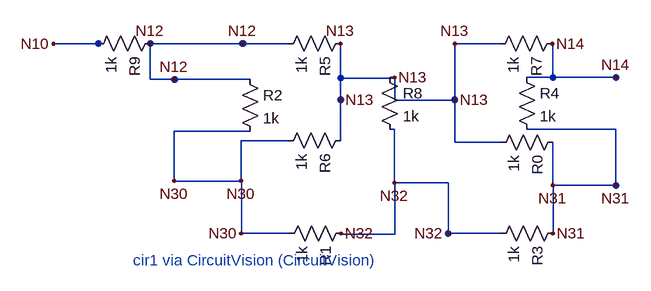
[diagram p0: schematic cir1.asc]
cir1.asc, the LTspice schematic file:
Version 4
SHEET 1 2000 1600
SYMBOL res 702 158 R90
SYMATTR InstName R0
SYMATTR Value 1k
WIRE 686 174 686 240
FLAG 686 240 N31
WIRE 606 174 535 174
WIRE 535 174 535 108
FLAG 535 108 N13
SYMBOL res 376 298 R90
SYMATTR InstName R1
SYMATTR Value 1k
FLAG 360 314 N32
WIRE 280 314 206 314
FLAG 206 314 N30
SYMBOL res 204 61 R0
SYMATTR InstName R2
SYMATTR Value 1k
WIRE 220 77 103 77
FLAG 103 77 N12
WIRE 220 157 103 157
WIRE 103 157 103 233
FLAG 103 233 N30
SYMBOL res 702 298 R90
SYMATTR InstName R3
SYMATTR Value 1k
FLAG 686 314 N31
WIRE 606 314 525 314
FLAG 525 314 N32
SYMBOL res 630 58 R0
SYMATTR InstName R4
SYMATTR Value 1k
WIRE 646 74 783 74
FLAG 783 74 N14
WIRE 646 154 783 154
WIRE 783 154 783 240
FLAG 783 240 N31
SYMBOL res 375 6 R90
SYMATTR InstName R5
SYMATTR Value 1k
FLAG 359 22 N13
WIRE 279 22 208 22
FLAG 208 22 N12
SYMBOL res 375 155 R90
SYMATTR InstName R6
SYMATTR Value 1k
WIRE 359 171 359 108
FLAG 359 108 N13
WIRE 279 171 206 171
WIRE 206 171 206 233
FLAG 206 233 N30
SYMBOL res 701 6 R90
SYMATTR InstName R7
SYMATTR Value 1k
FLAG 685 22 N14
WIRE 605 22 535 22
FLAG 535 22 N13
SYMBOL res 419 58 R0
SYMATTR InstName R8
SYMATTR Value 1k
WIRE 435 74 442 74
FLAG 442 74 N13
WIRE 435 154 442 154
WIRE 442 154 442 236
FLAG 442 236 N32
SYMBOL res 82 6 R90
SYMATTR InstName R9
SYMATTR Value 1k
FLAG 66 22 N12
WIRE -13 22 -83 22
FLAG -83 22 N10
WIRE 104 77 66 77
WIRE 207 234 104 234
WIRE 207 315 207 234
WIRE 359 109 359 22
WIRE 359 75 359 109
WIRE 360 315 443 315
WIRE 443 109 443 75
WIRE 443 236 525 236
WIRE 443 315 443 236
WIRE 443 75 359 75
WIRE 525 236 525 315
WIRE 535 109 443 109
WIRE 535 109 535 22
WIRE 66 22 209 22
WIRE 66 77 66 22
WIRE 686 74 686 22
WIRE 687 240 687 315
WIRE 687 240 784 240
WIRE 784 74 686 74
TEXT 40 355 Left 2 cir1 via CircuitVision (CircuitVision)

The netlist it stands for:
* cir1.asc
R0 N31 N13 1k
R1 N32 N30 1k
R2 N12 N30 1k
R3 N31 N32 1k
R4 N14 N31 1k
R5 N13 N12 1k
R6 N13 N30 1k
R7 N14 N13 1k
R8 N13 N32 1k
R9 N12 N10 1k
* cir1 via CircuitVision (CircuitVision)
.backanno
.end